# Altium project UTDFlightComputer.PrjPcb
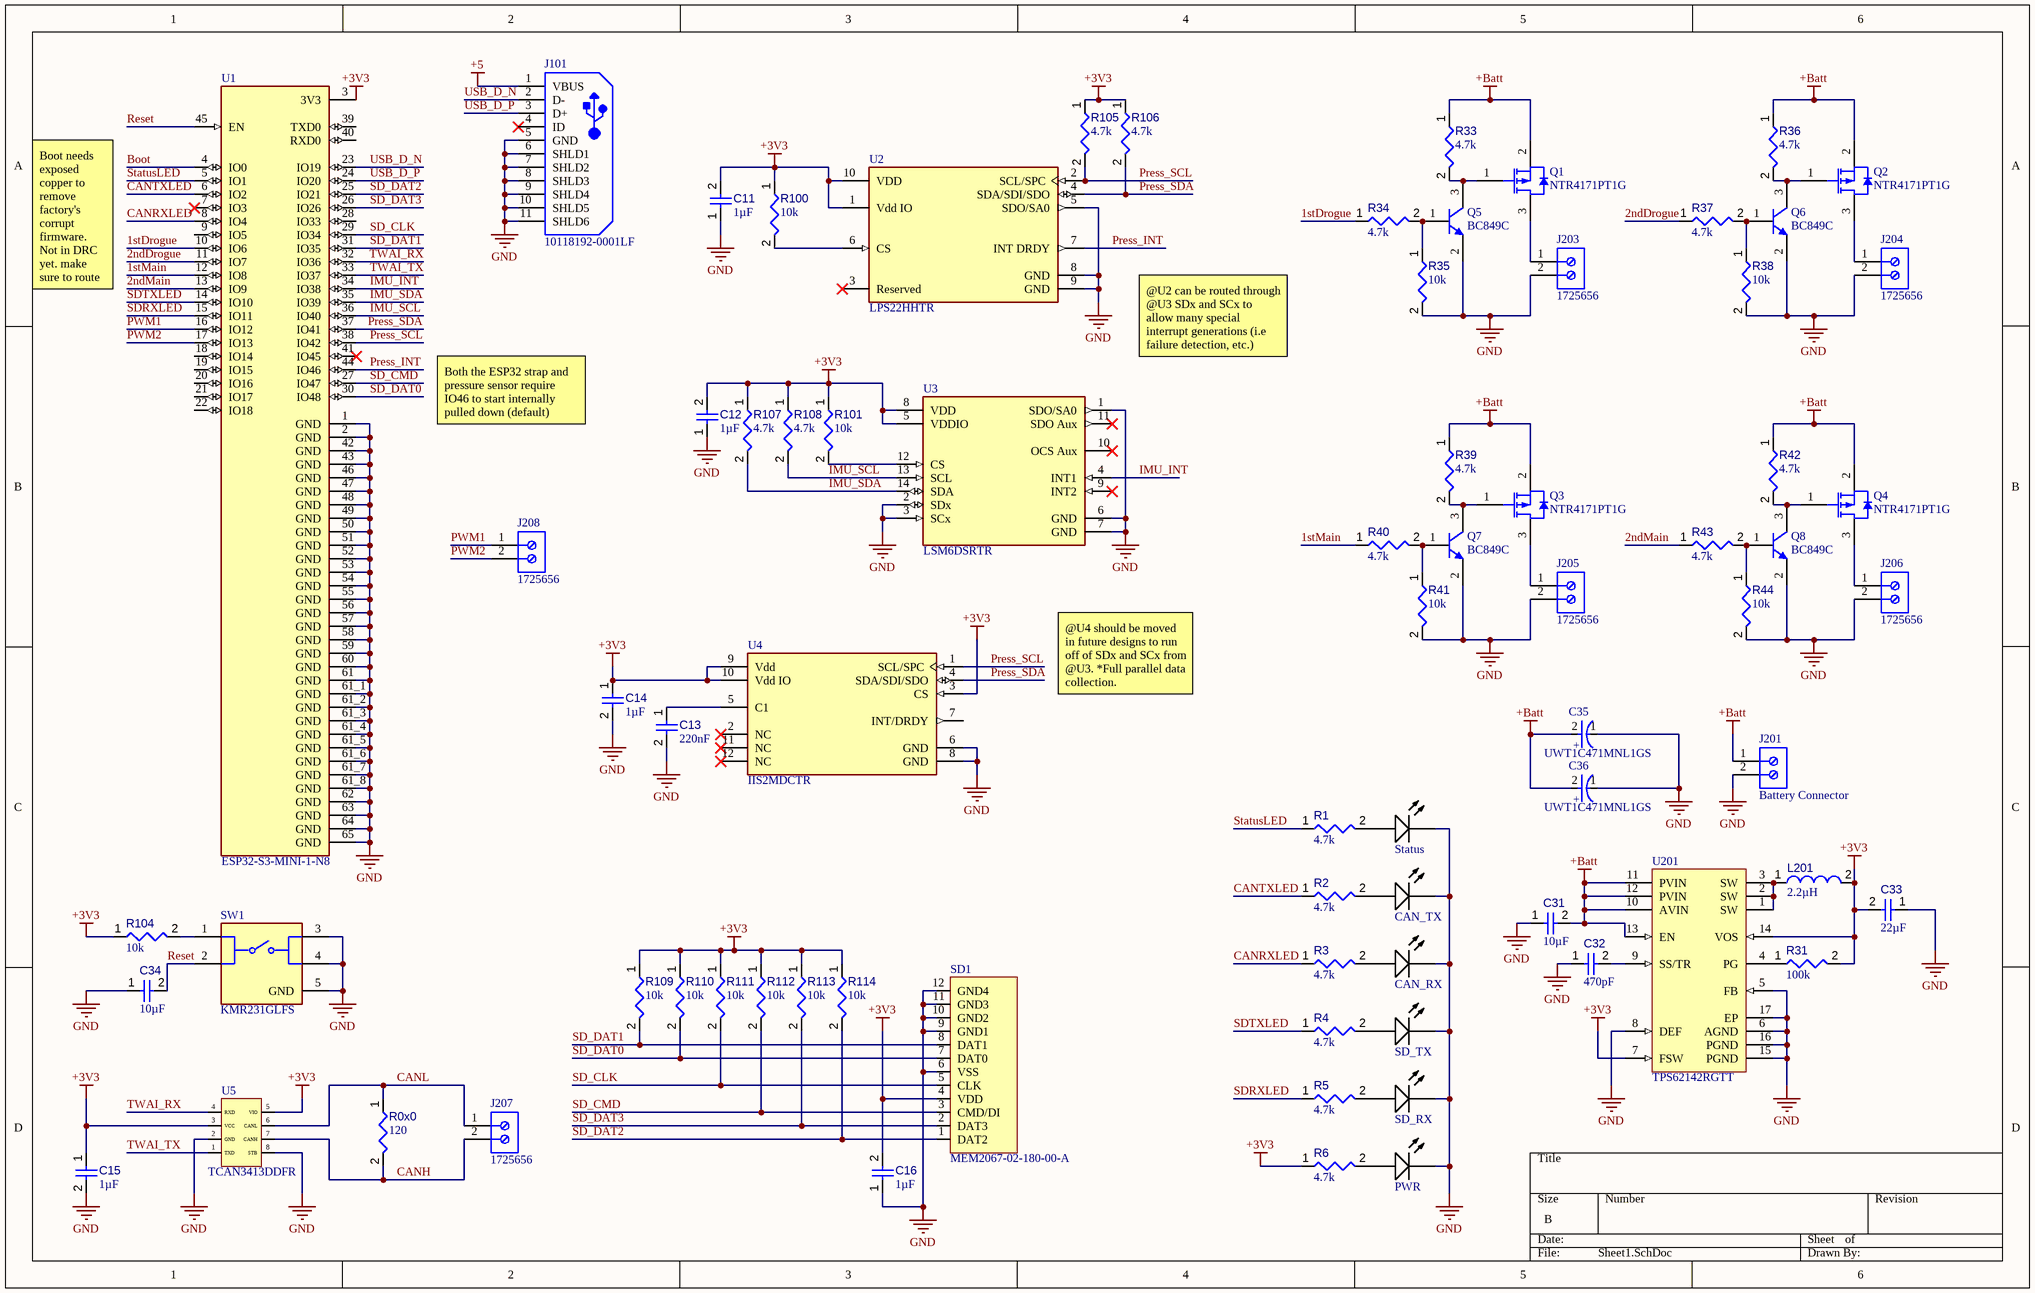
[diagram p0: Sheet1.SchDoc]
1 sheet, 76 parts. Net scope: global (net labels, ports and power ports of the same name join across sheets).
Board file: Main.PcbDoc

## Sheet Sheet1.SchDoc
size B; SheetNumber: 1; SheetTotal: 1

### Parts
C11  value 1µF  [CAPC1005X55X25LL05T10]  (hidden comment: Capacitor 1 uF +/- 10% 6.3 V 0402)
C12  value 1µF  [CAPC1005X55X25LL05T10]  (hidden comment: Capacitor 1 uF +/- 10% 6.3 V 0402)
C13  value 220nF  [CAPC0402(1005)60_L]  (hidden comment: Capacitor 220nF +/-20% 10V 0402)
C14  value 1µF  [CAPC1005X55X25LL05T10]  (hidden comment: Capacitor 1 uF +/- 10% 6.3 V 0402)
C15  value 1µF  [CAPC1005X55X25LL05T10]  (hidden comment: Capacitor 1 uF +/- 10% 6.3 V 0402)
C16  value 1µF  [CAPC1005X55X25LL05T10]  (hidden comment: Capacitor 1 uF +/- 10% 6.3 V 0402)
C31  value 10µF  [CAPC0603(1608)100_L]  (hidden comment: Capacitor 10µF +/-20% 10V 0603)
C32  value 470pF  [CAPC0603(1608)100_L]  (hidden comment: Capacitor 470pF +/-20% 50V 0402)
C33  value 22µF  [CAPC0603(1608)100_L]  (hidden comment: Capacitor 10µF +/-20% 10V 0603)
C34  value 10µF  [CAPC0603(1608)100_L]  (hidden comment: Capacitor 10µF +/-20% 10V 0603)
C35  UWT1C471MNL1GS  [FP-UWT1C471MNL1GS-MFG]
C36  UWT1C471MNL1GS  [FP-UWT1C471MNL1GS-MFG]
CAN_RX  HSMW-C191  [AVAG-HSMW-C191_V]  (value not drawn)
CAN_TX  HSMW-C191  [AVAG-HSMW-C191_V]  (value not drawn)
J101  10118192-0001LF  [FCI-10118192-0001LF-5_V]
J201  Battery Connector  [PHOE-1725656-2]
J203  1725656  [PHOE-1725656-2]
J204  1725656  [PHOE-1725656-2]
J205  1725656  [PHOE-1725656-2]
J206  1725656  [PHOE-1725656-2]
J207  1725656  [PHOE-1725656-2]
J208  1725656  [PHOE-1725656-2]
L201  value 2.2µH  [INDC2520X100X60NL20T20]  (hidden comment: LQM2HPN2R2MG0L)
PWR  HSMW-C191  [AVAG-HSMW-C191_V]  (value not drawn)
Q1  NTR4171PT1G  [ONSC-SOT-23-3-318-08_V]
Q2  NTR4171PT1G  [ONSC-SOT-23-3-318-08_V]
Q3  NTR4171PT1G  [ONSC-SOT-23-3-318-08_V]
Q4  NTR4171PT1G  [ONSC-SOT-23-3-318-08_V]
Q5  BC849C  [INF-SOT23_L]
Q6  BC849C  [INF-SOT23_L]
Q7  BC849C  [INF-SOT23_L]
Q8  BC849C  [INF-SOT23_L]
R0x0  value 120  [RESC0603(1608)_L]  (hidden comment: Resistor 120R +/-5 % 0603 0.1 W)
R1  value 4.7k  [RESC1005X40X25ML05T05]  (hidden comment: Resistor 4k7 +/-1% 0402 63 mW)
R2  value 4.7k  [RESC1005X40X25ML05T05]  (hidden comment: Resistor 4k7 +/-1% 0402 63 mW)
R3  value 4.7k  [RESC1005X40X25ML05T05]  (hidden comment: Resistor 4k7 +/-1% 0402 63 mW)
R4  value 4.7k  [RESC1005X40X25ML05T05]  (hidden comment: Resistor 4k7 +/-1% 0402 63 mW)
R5  value 4.7k  [RESC1005X40X25ML05T05]  (hidden comment: Resistor 4k7 +/-1% 0402 63 mW)
R6  value 4.7k  [RESC1005X40X25ML05T05]  (hidden comment: Resistor 4k7 +/-1% 0402 63 mW)
R31  value 100k  [RESC0402(1005)_L]  (hidden comment: Resistor 100K +/-1 % 0402 63 mW)
R33  value 4.7k  [RESC1005X40X25ML05T05]  (hidden comment: Resistor 4k7 +/-1% 0402 63 mW)
R34  value 4.7k  [RESC1005X40X25ML05T05]  (hidden comment: Resistor 4k7 +/-1% 0402 63 mW)
R35  value 10k  [RESC1005X40X25ML05T05]  (hidden comment: Resistor 10k +/-1% 0402 63 mW)
R36  value 4.7k  [RESC1005X40X25ML05T05]  (hidden comment: Resistor 4k7 +/-1% 0402 63 mW)
R37  value 4.7k  [RESC1005X40X25ML05T05]  (hidden comment: Resistor 4k7 +/-1% 0402 63 mW)
R38  value 10k  [RESC1005X40X25ML05T05]  (hidden comment: Resistor 10k +/-1% 0402 63 mW)
R39  value 4.7k  [RESC1005X40X25ML05T05]  (hidden comment: Resistor 4k7 +/-1% 0402 63 mW)
R40  value 4.7k  [RESC1005X40X25ML05T05]  (hidden comment: Resistor 4k7 +/-1% 0402 63 mW)
R41  value 10k  [RESC1005X40X25ML05T05]  (hidden comment: Resistor 10k +/-1% 0402 63 mW)
R42  value 4.7k  [RESC1005X40X25ML05T05]  (hidden comment: Resistor 4k7 +/-1% 0402 63 mW)
R43  value 4.7k  [RESC1005X40X25ML05T05]  (hidden comment: Resistor 4k7 +/-1% 0402 63 mW)
R44  value 10k  [RESC1005X40X25ML05T05]  (hidden comment: Resistor 10k +/-1% 0402 63 mW)
R100  value 10k  [RESC1005X40X25ML05T05]  (hidden comment: Resistor 10k +/-1% 0402 63 mW)
R101  value 10k  [RESC1005X40X25ML05T05]  (hidden comment: Resistor 10k +/-1% 0402 63 mW)
R104  value 10k  [RESC1005X40X25ML05T05]  (hidden comment: Resistor 10k +/-1% 0402 63 mW)
R105  value 4.7k  [RESC1005X40X25ML05T05]  (hidden comment: Resistor 4k7 +/-1% 0402 63 mW)
R106  value 4.7k  [RESC1005X40X25ML05T05]  (hidden comment: Resistor 4k7 +/-1% 0402 63 mW)
R107  value 4.7k  [RESC1005X40X25ML05T05]  (hidden comment: Resistor 4k7 +/-1% 0402 63 mW)
R108  value 4.7k  [RESC1005X40X25ML05T05]  (hidden comment: Resistor 4k7 +/-1% 0402 63 mW)
R109  value 10k  [RESC1005X40X25ML05T05]  (hidden comment: Resistor 10k +/-1% 0402 63 mW)
R110  value 10k  [RESC1005X40X25ML05T05]  (hidden comment: Resistor 10k +/-1% 0402 63 mW)
R111  value 10k  [RESC1005X40X25ML05T05]  (hidden comment: Resistor 10k +/-1% 0402 63 mW)
R112  value 10k  [RESC1005X40X25ML05T05]  (hidden comment: Resistor 10k +/-1% 0402 63 mW)
R113  value 10k  [RESC1005X40X25ML05T05]  (hidden comment: Resistor 10k +/-1% 0402 63 mW)
R114  value 10k  [RESC1005X40X25ML05T05]  (hidden comment: Resistor 10k +/-1% 0402 63 mW)
SD1  MEM2067-02-180-00-A  [MEM2067-02-180-00-A_REVB]
SD_RX  HSMW-C191  [AVAG-HSMW-C191_V]  (value not drawn)
SD_TX  HSMW-C191  [AVAG-HSMW-C191_V]  (value not drawn)
Status  HSMW-C191  [AVAG-HSMW-C191_V]  (value not drawn)
SW1  KMR231GLFS  [FP-KMR231GLFS-MFG]
U1  ESP32-S3-MINI-1-N8  [XCVR_ESP32-S3-MINI-1-N8]
U2  LPS22HHTR  [FP-HLGA-10L-DM00386636-MFG]
U3  LSM6DSRTR  [FP-LGA-14L-DM00249496-MFG]
U4  IIS2MDCTR  [FP-LGA-12-DM00170568-MFG]
U5  TCAN3413DDFR  [TSOP65P280X110-8N]
U201  TPS62142RGTT  [RGT0016C_V]

### Nets
+3V3: C11.2 C12.2 C14.1 C15.1 C16.2 C33.2 L201.2 R6.1 R31.2 R100.1 R101.1 R104.1 R105.1 R106.1 R107.1 R108.1 R109.1 R110.1 R111.1 R112.1 R113.1 R114.1 SD1.4(VDD) U1.3(3V3) U2.1(Vdd_IO) U2.10(VDD) U3.5(VDDIO) U3.8(VDD) U4.3(CS) U4.9(Vdd) U4.10(Vdd_IO) U5.3(VCC) U5.5(VIO) U201.7(FSW) U201.14(VOS)
+5: J101.1(VBUS)
+Batt: C31.2 C35.2(A) C36.2(A) J201.1 Q1.2(S) Q2.2(S) Q3.2(S) Q4.2(S) R33.1 R36.1 R39.1 R42.1 U201.10(AVIN) U201.11(PVIN) U201.12(PVIN) U201.13(EN)
GND: C11.1 C12.1 C13.2 C14.2 C15.2 C16.1 C31.1 C32.1 C33.1 C34.1 C35.1(C) C36.1(C) CAN_RX.2(K) CAN_TX.2(K) J101.5(GND) J101.6(SHLD1) J101.7(SHLD2) J101.8(SHLD3) J101.9(SHLD4) J101.10(SHLD5) J101.11(SHLD6) J201.2 J203.2 J204.2 J205.2 J206.2 PWR.2(K) Q5.2(E) Q6.2(E) Q7.2(E) Q8.2(E) R35.2 R38.2 R41.2 R44.2 SD1.6(VSS) SD1.9(GND1) SD1.10(GND2) SD1.11(GND3) SD1.12(GND4) SD_RX.2(K) SD_TX.2(K) Status.2(K) SW1.3 SW1.4 SW1.5(GND) U1.1(GND) U1.2(GND) U1.42(GND) U1.43(GND) U1.46(GND) U1.47(GND) U1.48(GND) U1.49(GND) U1.50(GND) U1.51(GND) U1.52(GND) U1.53(GND) U1.54(GND) U1.55(GND) U1.56(GND) U1.57(GND) U1.58(GND) U1.59(GND) U1.60(GND) U1.61(GND) U1.61_1(GND) U1.61_2(GND) U1.61_3(GND) U1.61_4(GND) U1.61_5(GND) U1.61_6(GND) U1.61_7(GND) U1.61_8(GND) U1.62(GND) U1.63(GND) U1.64(GND) U1.65(GND) U2.5(SDO/SA0) U2.8(GND) U2.9(GND) U3.1(SDO/SA0) U3.2(SDx) U3.3(SCx) U3.6(GND) U3.7(GND) U4.6(GND) U4.8(GND) U5.2(GND) U5.8(STB) U201.5(FB) U201.6(AGND) U201.8(DEF) U201.15(PGND) U201.16(PGND) U201.17(EP)
1stDrogue: R34.1 U1.10(IO6)
1stMain: R40.1 U1.12(IO8)
2ndDrogue: R37.1 U1.11(IO7)
2ndMain: R43.1 U1.13(IO9)
Boot: U1.4(IO0)
CANH: J207.2 R0x0.2 U5.7(CANH)
CANL: J207.1 R0x0.1 U5.6(CANL)
CANRXLED: R3.1 U1.8(IO4)
CANTXLED: R2.1 U1.6(IO2)
IMU_INT: U1.34(IO38) U3.4(INT1)
IMU_SCL: R108.2 U1.36(IO40) U3.13(SCL)
IMU_SDA: R107.2 U1.35(IO39) U3.14(SDA)
Press_INT: U1.44(IO46) U2.7(INT_DRDY)
Press_SCL: R105.2 U1.38(IO42) U2.2(SCL/SPC) U4.1(SCL/SPC)
Press_SDA: R106.2 U1.37(IO41) U2.4(SDA/SDI/SDO) U4.4(SDA/SDI/SDO)
PWM1: J208.1 U1.16(IO12)
PWM2: J208.2 U1.17(IO13)
Reset: C34.2 SW1.2 U1.45(EN)
SD_CLK: R111.2 SD1.5(CLK) U1.29(IO34)
SD_CMD: R112.2 SD1.3(CMD/DI) U1.27(IO47)
SD_DAT0: R110.2 SD1.7(DAT0) U1.30(IO48)
SD_DAT1: R109.2 SD1.8(DAT1) U1.31(IO35)
SD_DAT2: R114.2 SD1.1(DAT2) U1.25(IO21)
SD_DAT3: R113.2 SD1.2(DAT3) U1.26(IO26)
SDRXLED: R5.1 U1.15(IO11)
SDTXLED: R4.1 U1.14(IO10)
StatusLED: R1.1 U1.5(IO1)
TWAI_RX: U1.32(IO36) U5.4(RXD)
TWAI_TX: U1.33(IO37) U5.1(TXD)
USB_D_N: J101.2(D-) U1.23(IO19)
USB_D_P: J101.3(D+) U1.24(IO20)
NetC13_1: C13.1 U4.5(C1)
NetC32_2: C32.2 U201.9(SS/TR)
NetCAN_RX_1: CAN_RX.1(A) R3.2
NetCAN_TX_1: CAN_TX.1(A) R2.2
NetJ203_1: J203.1 Q1.3(D)
NetJ204_1: J204.1 Q2.3(D)
NetJ205_1: J205.1 Q3.3(D)
NetJ206_1: J206.1 Q4.3(D)
NetL201_1: L201.1 U201.1(SW) U201.2(SW) U201.3(SW)
NetPWR_1: PWR.1(A) R6.2
NetQ1_1: Q1.1(G) Q5.3(C) R33.2
NetQ2_1: Q2.1(G) Q6.3(C) R36.2
NetQ3_1: Q3.1(G) Q7.3(C) R39.2
NetQ4_1: Q4.1(G) Q8.3(C) R42.2
NetQ5_1: Q5.1(B) R34.2 R35.1
NetQ6_1: Q6.1(B) R37.2 R38.1
NetQ7_1: Q7.1(B) R40.2 R41.1
NetQ8_1: Q8.1(B) R43.2 R44.1
NetR1_2: R1.2 Status.1(A)
NetR4_2: R4.2 SD_TX.1(A)
NetR5_2: R5.2 SD_RX.1(A)
NetR31_1: R31.1 U201.4(PG)
NetR100_2: R100.2 U2.6(CS)
NetR101_2: R101.2 U3.12(CS)
NetR104_2: R104.2 SW1.1

Not connected (* = marked no-connect by the designer): J101 4(ID)*; U1 7(IO3)* 9(IO5) 18(IO14) 19(IO15) 20(IO16) 21(IO17) 22(IO18) 28(IO33) 39(TXD0) 40(RXD0) 41(IO45)*; U2 3(Reserved)*; U3 9(INT2)* 10(OCS_Aux)* 11(SDO_Aux)*; U4 2(NC)* 7(INT/DRDY) 11(NC)* 12(NC)*

### Notes on the sheet
- Boot needs exposed copper to remove factory's corrupt firmware. Not in DRC yet. make sure to route
- @U2 can be routed through @U3 SDx and SCx to allow many special interrupt generations (i.e failure detection, etc.)
- Both the ESP32 strap and pressure sensor require IO46 to start internally pulled down (default)
- @U4 should be moved in future designs to run off of SDx and SCx from @U3. *Full parallel data collection.
- (in symbol CMP-12462-000039-1) +

### Library data of the parts
C11 C12 C14-C16 = CMP-001-00008-6: Chip Capacitor, 1 uF, +/- 10%, 6.3 V, 0402 (1005 Metric); Capacitor Type: Ceramic; Voltage Rating: 6.3V; Max Operating Temperature: 85°C; Mounting Technology: SM; Tolerance: 10%; Case/Package: 0402; RoHS Compliant: True; Min Operating Temperature: -55°C; Pins: 2
C13 = CMP-001-00057-3: Chip Capacitor, 220nF +/-20%, 10V, 0402, Thickness 0.6 mm; Tolerance: 10%; Max Operating Temperature: 85°C; Pins: 2; Case/Package: 0402; Mounting Technology: SMT; Voltage Rating: 10V; Min Operating Temperature: -55°C
C31 C33 C34 = CMP-001-00075-4: Chip Capacitor, 10µF +/-20%, 10V, 0603, Thickness 1 mm; Tolerance: 10%; Voltage Rating: 10V; Max Operating Temperature: 85°C; Pins: 2; Case/Package: 0603; Mounting Technology: SMT; Min Operating Temperature: -55°C
C32 = CMP-001-00075-4: Chip Capacitor, 470pF +/-20%, 10V, 0603, Thickness 1 mm; Tolerance: 10%; Voltage Rating: 10V; Max Operating Temperature: 85°C; Pins: 2; Case/Package: 0603; Mounting Technology: SMT; Min Operating Temperature: -55°C
C35 C36 = CMP-12462-000039-1: CAP ALUM 470UF 20% 16V SMD; Dielectric Material: Aluminium; Dissipation Factor: 0.2%; Ripple Current: 230mA; Leakage Current: 3uA; Life (Hours): 1000Hour; Packaging: Tape and Reel; Min Operating Temperature: -55°C; Voltage: 16V; Package Quantity: 1; Tolerance: 20%; Case/Package: Radial; REACH SVHC: No SVHC; Ripple Current (AC): 230mA; Height: 10mm; Construction: Cylindrical; Number of Pins: 2; Capacitance: 470uF; RoHS Compliant: Yes; Radiation Hardening: No; Voltage Rating (DC): 16V; Voltage Rating: 16V; Length: 10mm; Series: WT; Lead Free: Lead Free; Mount: Surface Mount; Height - Seated (Max): 0.394inch; Diameter: 8mm; Max Operating Temperature: 105°C; Termination: SMD/SMT
CAN_RX CAN_TX PWR SD_RX SD_TX Status = CMP-007-00016-2: LED Uni-Color White, 78 mW, 20 mA, -40 to 85 degC, 2-Pin SMD, RoHS, Tape and Reel; Manufacturer: Avago; Power: 78mW; Lens Style: Diffused; Luminous Intensity: 200mcd; Forward Voltage: 3.6V; Viewing Angle: 140degrees; Forward Current: 20mA; Illumination Colour: White; Package Quantity: 4000; Mounting Technology: SM; Colour: White; Case/Package: 0603; Package Reference: HSMW-C191; Datasheet Version: May-10; Pins: 2; Package Description: 2-Pin Surface Mount Device, Body 1.6 x 0.8 mm; Min Operating Temperature: -40°C; RoHS Compliant: True; Packaging: TapeandReel; Manufacturer URL: http://www.avagotech.com/; Datasheet URL: http://docs.avagotech.com/docs/AV02-0186EN; Nominal Vf: 3.6V; Max Operating Temperature: 85°C
J101 = CMP-2000-05118-1: Micro USB B Type Receptacle, -55 to 85 degC, 5-Pin SMD, RoHS, Tape and Reel; Manufacturer: FCI; Current Rating: 1.8A; Number of Contacts: 5Contact; Mounting Angle: Right; Insulation Resistance: 1000MOhms; Connector Type: MicroUSBTypeBreceptacle; Gender: Female; Packaging: Reel; Termination Style: SMD/SMT; Product Category: USBConnectors; RoHS: Details; Flammability Rating: UL94V-0; Standard: USB2.0; Brand: FCI; Manufacturer URL: http://www.fci.com/; Product: MicroUSBTypeBConnectors; Operating Temperature Range: -55Cto+85C; Datasheet Version: Rev. B, 05/2015; Contact Material: CopperAlloy; Contact Plating: Gold; Datasheet URL: http://www.mouser.com/ds/2/154/10118192-793027.pdf; Color: Black; Factory Pack Quantity: 1400
J201 = CMP-2000-05299-1: Male Header, Pitch 2.54 mm, 1 x 2 Position, Height 9 mm, Tail Length 3.5 mm; Manufacturer part No.: 1725656; Manufacturer: Phoenix Contact; Number of contacts: 2; Content: 250pc(s); Pitch: 2.54mm; Industrial packaging: Yes; Colour: Green; Type: MPT0,5/2-2,54; Datasheet URL: http://datasheet.octopart.com/1725656-Phoenix-Contact-datasheet-5302866.pdf; Manufacturer URL: http://www.phoenixcontact.com/; Datasheet Version: Apr-08
J203-J208 = CMP-2000-05299-1: Male Header, Pitch 2.54 mm, 1 x 2 Position, Height 9 mm, Tail Length 3.5 mm; Manufacturer: Phoenix Contact; Number of contacts: 2; Content: 250pc(s); Pitch: 2.54mm; Industrial packaging: Yes; Colour: Green; Manufacturer part No.: 1725656; Type: MPT0,5/2-2,54; Datasheet URL: http://datasheet.octopart.com/1725656-Phoenix-Contact-datasheet-5302866.pdf; Manufacturer URL: http://www.phoenixcontact.com/; Datasheet Version: Apr-08
L201 = CMP-006-00009-6: Chip Inductor, 2.2 uH, +/- 20%, -55 to 125 degC, 1008 (2520 Metric), RoHS, Tape and Reel; Manufacturer: Murata; Self Resonant Frequency: 40MHz; Current Rating: 1.3A; Core Material: Ferrite; Shielding: Shielded; Package Description: 2-Pin Surface Mounted Device, Body 2.5 x 2 mm; Tolerance: 20%; Max Operating Temperature: 125°C; Mounting Technology: SM; Package Reference: 1008; Case/Package: 1008; RoHS Compliant: True; Package Quantity: 3000; Packaging: TapeandReel; Min Operating Temperature: -55°C; Datasheet URL: http://psearch.en.murata.com/inductor/product/LQM2HPN2R2MG0%23.pdf; Datasheet Version: Aug-16
Q1-Q4 = CMP-1058-00738-1: Power MOSFET, -30 V, 3.5 A, Single P-Channel, 3-Pin SOT-23, Pb-Free, Tape and Reel; Manufacturer: On Semiconductor; VGS Max (V): 12; V(BR)DSS Min (V): 30; Crss Typ (pF): 65; VGS(th) Max (V): 1.4; Ciss Typ (pF): 720; Qrr Typ (nC): 8; Coss Typ (pF): 95; Channel Polarity: P Channel; ComponentLink2URL: http://www.onsemi.cn/pub_link/Collateral/NTR4171P-D.PDF; ComponentLink1Description: Manufacturer URL; PartNumber: NTR4171PT1G; Mounting Technology: Surface Mount; ComponentLink1URL: http://www.onsemi.com/; Packing: Tape and Reel; Package Type: SOT-23-3; ComponentLink2Description: Datasheet; PackageReference: SOT-23-3-318-08; Configuration: Single; ComponentLink3Description: Package Specification; DatasheetVersion: Rev. 1; PackageVersion: Rev. AP, 11/2009; RoHS: Pb-Free; PackageDescription: 3-Pin Small Outline Transistor, Body 2.92 x 1.3 mm, Pitch 0.95 mm; ComponentLink3URL: http://www.onsemi.cn/pub_link/Collateral/318-08.PDF
Q5-Q8 = CMP-1177-00028-1: NPN Silicon AF Transistor, 30 V VCEO, 100 mA IC, SOT23, Reel, Green; Manufacturer: Infineon; ICM (max): 200Â mA; VCEO (max): 30Â V; IC (max): 100Â mA; ICBO (max): 15Â nA; Green: TRUE; fT (typ): 250Â MHz; VEBO (max): 6Â V; F (typ): 1.2Â dB; Ptot (max): 330Â mW; PartNumber: BC849C; Polarity: NPN; PackageReference: SOT23; ComponentLink2URL: http://www.infineon.com/dgdl/bc847series_bc848series_bc849series_bc850series.pdf?folderId=db3a304314dca389011541d30fa21656&fileId=db3a304314dca389011541d4630a1657; ComponentLink2Description: Datasheet; PackageDescription: 3-Pin Small Outline Transistor Package, 1.3 x 2.9 mm Body, 0.95 mm Pitch; VCBO (max): 30Â V; Packing: Reel; ComponentLink1URL: http://www.infineon.com/; PackageVersion: Apr-08; IBM (max): 200Â mA; ComponentLink3URL: http://www.infineon.com/dgdl/SOT23-Package_Overview.pdf?folderId=db3a30431936bc4b0119532290053c66&fileId=db3a30431936bc4b0119533468123c85; Mounting Technology: Surface Mount; ComponentLink1Description: Manufacturer URL; ComponentLink3Description: Package Specification
R0x0 = CMP-009-00176-3: Chip Resistor, 120 Ohms, +/-5 %, 0.1 W, -55 to 155 degC, 0603; Power: 100mW; Tolerance: 5%; Max Operating Temperature: 155°C; Pins: 2; Case/Package: 0603; Min Operating Temperature: -55°C
R1-R6 R33 R34 R36 R37 R39 R40 R42 R43 R105-R108 = CMP-009-00034-5: Chip Resistor, 4.7 KOhm, +/- 1%, 63 mW, -55 to 155 degC, 0402 (1005 Metric); Power: 63mW; Voltage Rating: 50V; Case/Package: 0402; Tolerance: 1%; Max Operating Temperature: 155°C; Pins: 2; RoHS Compliant: True; Min Operating Temperature: -55°C; Mounting Technology: SM
R31 = CMP-009-00168-3: Chip Resistor, 100 kOhms, +/-1 %, 63 mW, -55 to 155 degC, 0402; Tolerance: 1%; Power: 63mW; Max Operating Temperature: 155°C; Min Operating Temperature: -55°C; Pins: 2; Case/Package: 0402
R35 R38 R41 R44 R100 R101 R104 R109-R114 = CMP-009-00019-5: Chip Resistor, 10 KOhm, +/- 1%, 63 mW, -55 to 155 degC, 0402 (1005 Metric); Power: 63mW; Voltage Rating: 50V; Case/Package: 0402; Mounting Technology: SM; Pins: 2; Min Operating Temperature: -55°C; Tolerance: 1%; RoHS Compliant: True; Max Operating Temperature: 155°C
SD1 = CMP-013-000000-1: MICRO SD HINGED, SMT, 1.80MM PRO; Manufacturer: Global Connector Technology; Connector Type: PCB; Contact Finish - Termination: Tin (Sn) - with Nickel (Ni) barrier; ComponentLink8Description: https://datasheet.octopart.com/MEM2067-02-180-00-A-Global-Connector-Technology-datasheet-77992480.pdf?src-supplier=Future+Electronics; JESD-609 Code: e3; Category: Connectors; Reach SVHC Compliant: Yes; ComponentLink1URL: https://datasheet.ciiva.com:443/pdfs/VipMasterIC/IC/GCTI/GCTI-S-A0009044757/GCTI-S-A0009044757-1.pdf?src-supplier=IHS+Markit; Contact Material: Copper Alloy; ComponentLink9URL: https://datasheet.octopart.com/MEM2067-02-180-00-A-Global-Connector-Technology-datasheet-91940696.pdf?src-supplier=TME; ComponentLink7Description: https://datasheet.octopart.com/MEM2067-02-180-00-A-Global-Connector-Technology-datasheet-36736608.pdf?src-supplier=Element14; Stock: 6262; LCSC#: C5124832; RoHS Compliant: Yes; ComponentLink3URL: http://www.farnell.com/datasheets/1876941.pdf?src-supplier=Farnell; RoHS: Yes; Source: fc_2025.SchLib; ComponentLink3Description: http://www.farnell.com/datasheets/1876941.pdf?src-supplier=Farnell; Pricing: 1=1.41, 10=1.075, 25=0.9668, 50=0.8934, 100=0.8263, 250=0.74696, 500=0.6933 (USD); Contact Finish - Mating: GOLD FLASH OVER NICKEL (50); ComponentLink7URL: https://datasheet.octopart.com/MEM2067-02-180-00-A-Global-Connector-Technology-datasheet-36736608.pdf?src-supplier=Element14; Manufacturer Part Number: MEM2067-02-180-00-A; ComponentLink1Description: https://datasheet.ciiva.com:443/pdfs/VipMasterIC/IC/GCTI/GCTI-S-A0009044757/GCTI-S-A0009044757-1.pdf?src-supplier=IHS+Markit; ComponentLink4Description: https://datasheet.octopart.com/MEM2067-02-180-00-A-Global-Connector-Technology-datasheet-91940696.pdf?src-supplier=Farnell; ComponentLink5Description: https://gct.co/files/drawings/mem2067.pdf?src-supplier=Digikey; ComponentLink2Description: http://www.farnell.com/datasheets/2342925.pdf?src-supplier=Farnell; ComponentLink6Description: http://www.farnell.com/datasheets/1876941.pdf?src-supplier=Element14; ComponentLink5URL: https://gct.co/files/drawings/mem2067.pdf?src-supplier=Digikey; Design Item ID: MEM2067-02-180-00-A; ComponentLink9Description: https://datasheet.octopart.com/MEM2067-02-180-00-A-Global-Connector-Technology-datasheet-91940696.pdf?src-supplier=TME; ComponentLink2URL: http://www.farnell.com/datasheets/2342925.pdf?src-supplier=Farnell; ComponentLink6URL: http://www.farnell.com/datasheets/1876941.pdf?src-supplier=Element14; ComponentLink4URL: https://datasheet.octopart.com/MEM2067-02-180-00-A-Global-Connector-Technology-datasheet-91940696.pdf?src-supplier=Farnell; ComponentLink8URL: https://datasheet.octopart.com/MEM2067-02-180-00-A-Global-Connector-Technology-datasheet-77992480.pdf?src-supplier=Future+Electronics
SW1 = CMP-2000-06516-3: SWITCH TACTILE SPST-NO 0.05A 32V; Switch Travel: 0.25mm; Current Rating: 50mA; Operating Force: 3N; Actuator Type: Standard; Illumination Type: Non-Illuminated; Mechanical Life: 150000Cycles; Insulation Resistance: 1GR; Contact Resistance: 100mR; Actuator Length: 0.5mm; Power Rating: 1W; Throw Configuration: SPST; Switch Function: Off-Mom; Min Operating Temperature: -40°C; Termination: Gull Wing; Orientation: Straight; Lead Free: Lead Free; Width: 2.8mm; Contact Material: Silver; Max Voltage Rating (DC): 32V; Max Current Rating: 50mA; Contact Plating: Silver; Radiation Hardening: No; Depth: 4.6mm; Mount: Surface Mount; Max Operating Temperature: 85°C; Case/Package: SMD/SMT; Contact Current Rating: 50mA; Length: 4.6mm; Package Quantity: 7000; Series: KMR2; REACH SVHC: No SVHC; Packaging: Cut Tape; Voltage Rating (DC): 32V
U1 = CMP-020-00024-1: MF: {'manufacturer': u'Espressif Systems'}; Availability: Unavailable; Pins: 73; Component Type: Standard; Price: None; Case/Package: None; Design Item ID: ESP32-S3-MINI-1-N8; Source: ESP32-S3-MINI-1-N8.SchLib; MP: ESP32-S3-MINI-1-N8; Value: *
U2 = CMP-12182-000001-1: CONSUMER MEMS; Manufacturer: STMicroelectronics; Operating Supply Current: 4-12uA; Sensor Output: I2C,SPI; Port Style: No Port; Min Supply Voltage: 1.7V; Max Supply Voltage: 3.7V; Package: HLGA-10L-DM00386636; Temperature Range Low: -40°C; RoHS: TRUE; Device Class L1: Sensors; Automotive: No; Manufacturer Part Number: LPS22HHTR; ComponentLink2URL: https://www.st.com/resource/en/datasheet/lps22hh.pdf; Temperature: -40°C to +85°C; Category: IC; Device Class L3: unset; ComponentLink2Description: Datasheet; Lead Free: Yes; Temperature Range High: +85°C; Octopart: https://octopart.com/lps22hhtr-stmicroelectronics-94834025; Footprint Url: https://www.st.com/content/ccc/resource/technical/document/technical_note/73/17/9c/16/dd/96/4a/01/CD00134799.pdf/files/CD00134799.pdf/jcr:content/translations/en.CD00134799.pdf; Height: 0.8mm; Device Class L2: Pressure Sensors; Digikey Description: CONSUMER MEMS
U3 = CMP-12177-000003-1: INEMO INERTIAL MODULE: 3D ACCELE; Manufacturer: STMicroelectronics; Sensor Output: I2C,SPI; Accel Range: 2/4/8/16g; Gyro Range: 125/250/500/1000/2000/4000°/s; Operating Supply Current: 360-1200uA; Max Supply Voltage: 3.6V; Min Supply Voltage: 1.62V; Sensor Type: Temperature,Accelerometer,Gyroscope; Device Class L3: Inertial Measurement Units (IMUs); Package: LGA-14L-DM00249496; ComponentLink2Description: Datasheet; Mouser Description: In a Pack of 2, LSM6DSRTR STMicroelectronics, 3-Axis Accelerometer, Gyroscope, 14-Pin LGA; Footprint Url: https://www.st.com/content/ccc/resource/technical/document/technical_note/73/17/9c/16/dd/96/4a/01/CD00134799.pdf/files/CD00134799.pdf/jcr:content/translations/en.CD00134799.pdf; RoHS: TRUE; Automotive: No; Temperature Range High: +85°C; Digikey Description: INEMO INERTIAL MODULE: 3D ACCELE; Manufacturer Part Number: LSM6DSRTR; ComponentLink2URL: https://www.st.com/resource/en/datasheet/lsm6dsr.pdf; Lead Free: Yes; Category: IC; Temperature Range Low: -40°C; Height: 0.86mm; Octopart: https://octopart.com/lsm6dsrtr-stmicroelectronics-93180177; Temperature: -40°C to +85°C; Device Class L1: Sensors; Device Class L2: Motion Sensors
U4 = CMP-12173-000003-1: SENSOR MR I2C/SPI 12LGA; Axis: X, Y, Z; Output Type: SPI; Sensing Method: Magnetoresistive; Resolution: 16b; Case/Package: LGA; Min Operating Temperature: -40°C; Packaging: Cut Tape; Number of Pins: 12; Max Operating Temperature: 85°C; RoHS Compliant: Yes
U5 = CMP-015-00008-1: 3.3-V CAN FD transceiver with flexible IO and standby mode 8-SOT-23-THIN -40 to 125
U201 = CMP-0323-00127-3: Buck Step Down Regulator with 3 to 17 V Input and 3.3 V Output, -40 to 85 degC, 16-Pin QFN (RGT), Green (RoHS & no Sb/Br); Manufacturer: Texas Instruments; Vin(Min)(V): 3; Synchronous Rectification: TRUE; Vin(Max)(V): 17; Iout(Max)(A): 2; Regulated Outputs(#): 1; Vout(Min)(V): 3.3; Iq(Typ)(mA): 0.017; Rating: Catalog; SubFamily: Step-Down Regulator; Duty Cycle(Max)(%): 100; Code_JEDEC: MO-220; ComponentLink1Description: Datasheet; PackageReference: RGT0016C; PackageDescription: 16-Pin Plastic Quad Flat No-Lead, 3 x 3 mm Body, 0.5 mm Pitch, 1.7 x 1.7 mm Exposed Pad; ComponentLink2URL: http://www.ti.com/litv/pdf/mpqf119g; PartNumber: TPS62142RGTT; ComponentLink1URL: http://www.ti.com/general/docs/lit/getliterature.tsp?genericPartNumber=TPS62142&fileType=pdf; Switch Current Limit(Typ)(A): 3; ComponentLink3Description: URL Link1; Eco-Plan: Green (RoHS & no Sb/Br); Mounting Technology: Surface Mount; PackageVersion: revH, Oct-2011; ComponentLink3URL: Samples URL:http://www.ti.com/product/tps54611#samples; Preset Vout(V): 3.3; Vout(Max)(V): 3.3; ComponentLink2Description: Package Specification; Topology: Buck; DatasheetVersion: SLVSAJ0